# Altium schematic sheet bbb_db25_terminals_extension.SchDoc
size A4
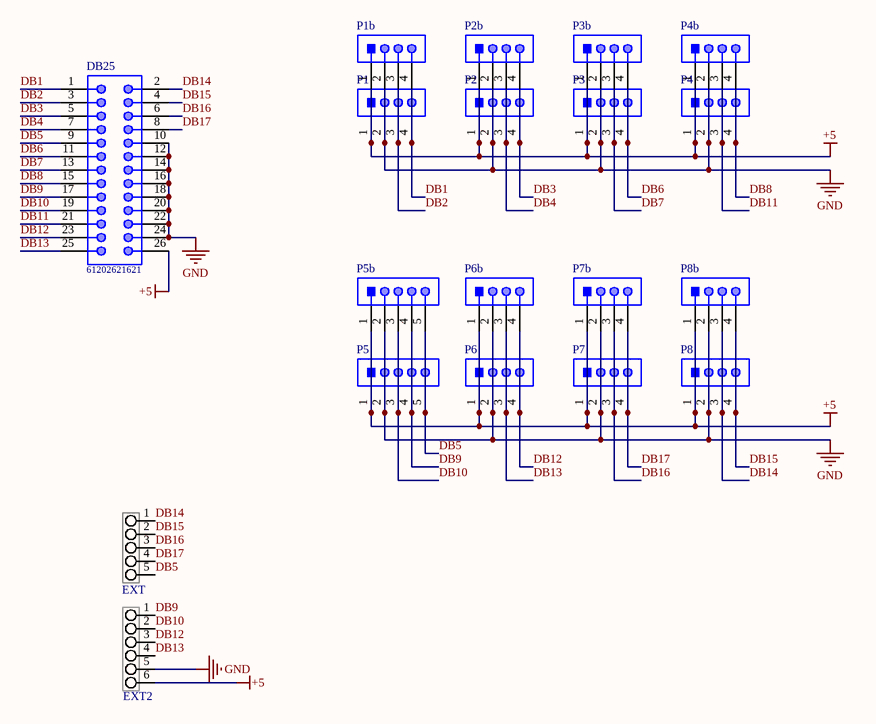
[diagram p0: bbb_db25_terminals_extension.SchDoc]

## Parts
DB25  61202621621  [61202621621]
EXT  Header 1x5 compact  [Header 1x5 100mil Vertical]  (value not drawn)
EXT2  Header 1x6 compact  [Header 1x6 100mil Vertical]  (value not drawn)
P1  691322110004  [691322110004]  (value not drawn)
P1b  691321100004  [691321100004]  (value not drawn)
P2  691322110004  [691322110004]  (value not drawn)
P2b  691321100004  [691321100004]  (value not drawn)
P3  691322110004  [691322110004]  (value not drawn)
P3b  691321100004  [691321100004]  (value not drawn)
P4  691322110004  [691322110004]  (value not drawn)
P4b  691321100004  [691321100004]  (value not drawn)
P5  691322110005  [691322110005]  (value not drawn)
P5b  691321100005  [691321100005]  (value not drawn)
P6  691322110004  [691322110004]  (value not drawn)
P6b  691321100004  [691321100004]  (value not drawn)
P7  691322110004  [691322110004]  (value not drawn)
P7b  691321100004  [691321100004]  (value not drawn)
P8  691322110004  [691322110004]  (value not drawn)
P8b  691321100004  [691321100004]  (value not drawn)

## Nets
+5: DB25.26 EXT2.6 P1.1 P1b.1 P2.1 P2b.1 P3.1 P3b.1 P4.1 P4b.1 P5.1 P5b.1 P6.1 P6b.1 P7.1 P7b.1 P8.1 P8b.1
GND: DB25.10 DB25.12 DB25.14 DB25.16 DB25.18 DB25.20 DB25.22 DB25.24 EXT2.5 P1.2 P1b.2 P2.2 P2b.2 P3.2 P3b.2 P4.2 P4b.2 P5.2 P5b.2 P6.2 P6b.2 P7.2 P7b.2 P8.2 P8b.2
DB1: DB25.1 P1.4 P1b.4
DB2: DB25.3 P1.3 P1b.3
DB3: DB25.5 P2.4 P2b.4
DB4: DB25.7 P2.3 P2b.3
DB5: DB25.9 EXT.5 P5.5 P5b.5
DB6: DB25.11 P3.4 P3b.4
DB7: DB25.13 P3.3 P3b.3
DB8: DB25.15 P4.4 P4b.4
DB9: DB25.17 EXT2.1 P5.4 P5b.4
DB10: DB25.19 EXT2.2 P5.3 P5b.3
DB11: DB25.21 P4.3 P4b.3
DB12: DB25.23 EXT2.3 P6.4 P6b.4
DB13: DB25.25 EXT2.4 P6.3 P6b.3
DB14: DB25.2 EXT.1 P8.3 P8b.3
DB15: DB25.4 EXT.2 P8.4 P8b.4
DB16: DB25.6 EXT.3 P7.3 P7b.3
DB17: DB25.8 EXT.4 P7.4 P7b.4

## Library data of the parts
DB25 = 61202621621: Male Box Header WR-BHD, THT, Vertical, pitch 2.54 mm, 26 pins; Pitch: 2.54 mm; Working Voltage: 250 VAC; Withstanding Voltage: 500 VAC; Contact Resistance: 20 mOhm; Pin Number: 26; ComponentLink1Description: Manufacturer; ComponentLink1URL: http://www.we-online.de; ComponentLink2Description: Datasheet; ComponentLink2URL: https://katalog.we-online.de/em/datasheet/6120xx21621.pdf; Part Number: 61202621621; Published Date: August 2018; Publisher: Wurth Elektronik; Operating Temperature: -40 to 125 degC; Packaging: Tray; Gender: Male; Mounting Technology: THT; Orientation: Vertical
EXT = Header 1x5 compact: Standard Header Connector
EXT2 = Header 1x6 compact: Standard Header Connector
P1-P4 P6-P8 = 691322110004: WR-TBL Serie 3221 Horizontal PCB Header, Pluggable, pitch 3.5mm, 4p; Compliance: Lead free / RoHS; Modularity: No; Pin Number: 4; Rated Current [UL]: 10A; Working Voltage [UL]: 300VAC; ComponentLink1Description: Manufacturer; ComponentLink1URL: http://www.we-online.de; ComponentLink2URL: https://katalog.we-online.de/em/datasheet/691322110004.pdf; ComponentLink2Description: Datasheet; Mounting Technology: THT; Part Number: 691322110004; Packaging: Box; Operating Temperature: -40 to +105degC; PCB/Cable/Panel: PCB; Pitch: 3.5mm; Published Date: October 2019; Type: Horizontal; Publisher: Wurth Elektronik; Application: Pluggable
P1b P2b P3b P4b P6b P7b P8b = 691321100004: WR-TBL Serie 3211 Vertical PCB Header, Pluggable, pitch 3.5mm, 4p; Compliance: RoHS; Modularity: No; Pin Number: 4; Rated Current [UL]: 10A; Working Voltage [UL]: 300VAC; ComponentLink1Description: Manufacturer; ComponentLink1URL: http://www.we-online.de; ComponentLink2URL: https://katalog.we-online.de/em/datasheet/691321100004.pdf; ComponentLink2Description: Datasheet; Mounting Technology: THT; Part Number: 691321100004; Packaging: Box; Operating Temperature: -40 to +105degC; PCB/Cable/Panel: PCB; Pitch: 3.5mm; Published Date: October 2019; Type: Vertical; Publisher: Wurth Elektronik; Application: Pluggable
P5 = 691322110005: WR-TBL Serie 3221 Horizontal PCB Header, Pluggable, pitch 3.5mm, 5p; Compliance: Lead free / RoHS; Modularity: No; Pin Number: 5; Rated Current [UL]: 10A; Working Voltage [UL]: 300VAC; ComponentLink1Description: Manufacturer; ComponentLink1URL: http://www.we-online.de; ComponentLink2URL: https://katalog.we-online.de/em/datasheet/691322110005.pdf; ComponentLink2Description: Datasheet; Mounting Technology: THT; Part Number: 691322110005; Packaging: Box; Operating Temperature: -40 to +105degC; PCB/Cable/Panel: PCB; Pitch: 3.5mm; Published Date: October 2019; Type: Horizontal; Publisher: Wurth Elektronik; Application: Pluggable
P5b = 691321100005: WR-TBL Serie 3211 Vertical PCB Header, Pluggable, pitch 3.5mm, 5p; Compliance: RoHS; Modularity: No; Pin Number: 5; Rated Current [UL]: 10A; Working Voltage [UL]: 300VAC; ComponentLink1Description: Manufacturer; ComponentLink1URL: http://www.we-online.de; ComponentLink2URL: https://katalog.we-online.de/em/datasheet/691321100005.pdf; ComponentLink2Description: Datasheet; Mounting Technology: THT; Part Number: 691321100005; Packaging: Box; Operating Temperature: -40 to +105degC; PCB/Cable/Panel: PCB; Pitch: 3.5mm; Published Date: October 2019; Type: Vertical; Publisher: Wurth Elektronik; Application: Pluggable